# EAGLE design PLM_WiFi_Adapter (EAGLE 7.2.0)
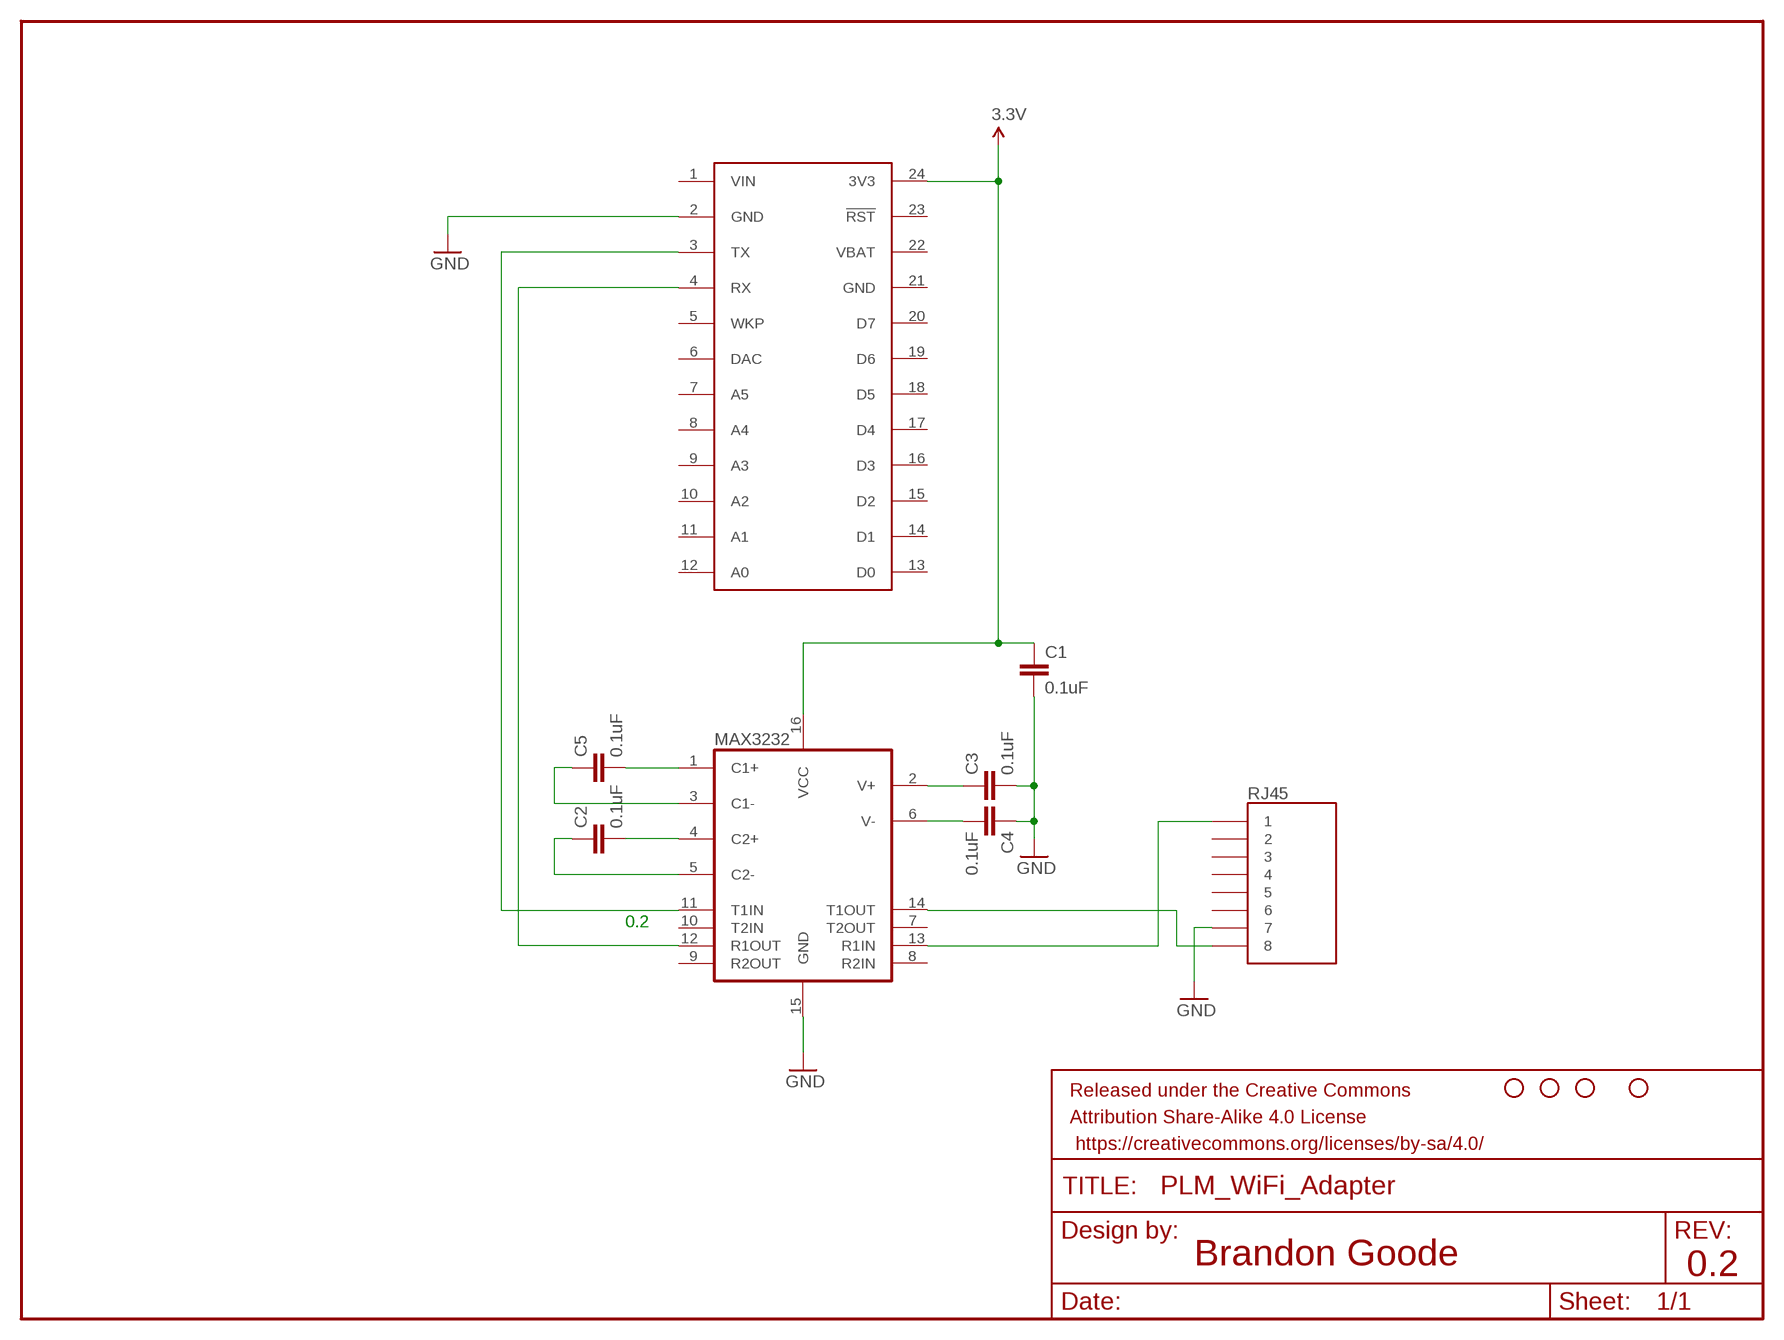
[diagram p0: schematic, sheet 1]

## Parts
C1  0.1uF  CAP0603-CAP  [0603-CAP]
C2  0.1uF  CAP0603-CAP  [0603-CAP]
C3  0.1uF  CAP0603-CAP  [0603-CAP]
C4  0.1uF  CAP0603-CAP  [0603-CAP]
C5  0.1uF  CAP0603-CAP  [0603-CAP]
FRAME1  FRAME-LETTER  [CREATIVE_COMMONS]
MAX3232  MAX232TSSOP  [TSSOP16]
RJ45  RJ45-8PTH  [RJ45-8]
SPARK  SPARK_CORECORE  [SPARK_CORE]
STANDOFF1  STAND-OFF  [STAND-OFF]
STANDOFF2  STAND-OFF  [STAND-OFF]
STANDOFF3  STAND-OFF  [STAND-OFF]
STANDOFF4  STAND-OFF  [STAND-OFF]

## Nets
3.3V: C1.1 MAX3232.16(VCC) SPARK.24(3V3)
GND: C1.2 C3.2 C4.1 MAX3232.15(GND) RJ45.7 SPARK.2(GND)
N$1: C5.2 MAX3232.1(C1+)
N$2: C3.1 MAX3232.2(V+)
N$3: C4.2 MAX3232.6(V-)
N$4: MAX3232.14(T1OUT) RJ45.8
N$5: MAX3232.13(R1IN) RJ45.1
N$6: C5.1 MAX3232.3(C1-)
N$7: C2.2 MAX3232.4(C2+)
N$8: C2.1 MAX3232.5(C2-)
N$9: MAX3232.11(T1IN) SPARK.3(TX)
N$10: MAX3232.12(R1OUT) SPARK.4(RX)
Unconnected: MAX3232.7(T2OUT) MAX3232.8(R2IN) MAX3232.9(R2OUT) MAX3232.10(T2IN) RJ45.2 RJ45.3 RJ45.4 RJ45.5 RJ45.6 SPARK.5(WKP) SPARK.6(DAC) SPARK.7(A5) SPARK.8(A4) SPARK.9(A3) SPARK.10(A2) SPARK.11(A1) SPARK.12(A0) SPARK.13(D0) SPARK.14(D1) SPARK.15(D2) SPARK.16(D3) SPARK.17(D4) SPARK.18(D5) SPARK.19(D6) SPARK.20(D7) SPARK.23(!RST)

## Notes on the sheet
- 0.2
- Brandon Goode
- 0.2

## Power pins joined to a net without a drawn wire
GND: SPARK.21(GND)
VBAT: SPARK.22(VBAT)
VIN: SPARK.1(VIN)

## Library data of the parts
C1-C5 = SparkFun-Passives:CAP: Capacitor Standard 0603 ceramic capacitor, and 0.1" leaded capacitor.
FRAME1 = SparkFun-Aesthetics:FRAME-LETTER: Schematic Frame Standard 8.5x11 US Letter frame
MAX3232 = SparkFun-DigitalIC:MAX232: RS232 Transceiver Very common IC. This is generically called 'MAX232', but works with the 3V equivalent MAX3232 generic ICs. Field tested and mother approved. Spark Fun Electronics SKU : COM-00316 (DIP) and COM-00589 (SMD)
RJ45 = SparkFun-Connectors:RJ45-8: RJ45 Jack Simple RJ45, 8-pin connection - connector for common Cat5, Cat5e, and Cat6 Ethernet cables. Footprint not yet proven in production. Connector sku is PRT-00643; Breakout PCB sku is BOB-00716.
SPARK = Spark:SPARK_CORE
STANDOFF1-STANDOFF4 = SparkFun-Electromechanical:STAND-OFF: #4 Stand Off This is the mechanical footprint for a #4 phillips button head screw. Use the keepout ring to avoid running the screw head into surrounding components. SKU : PRT-00447

## Board
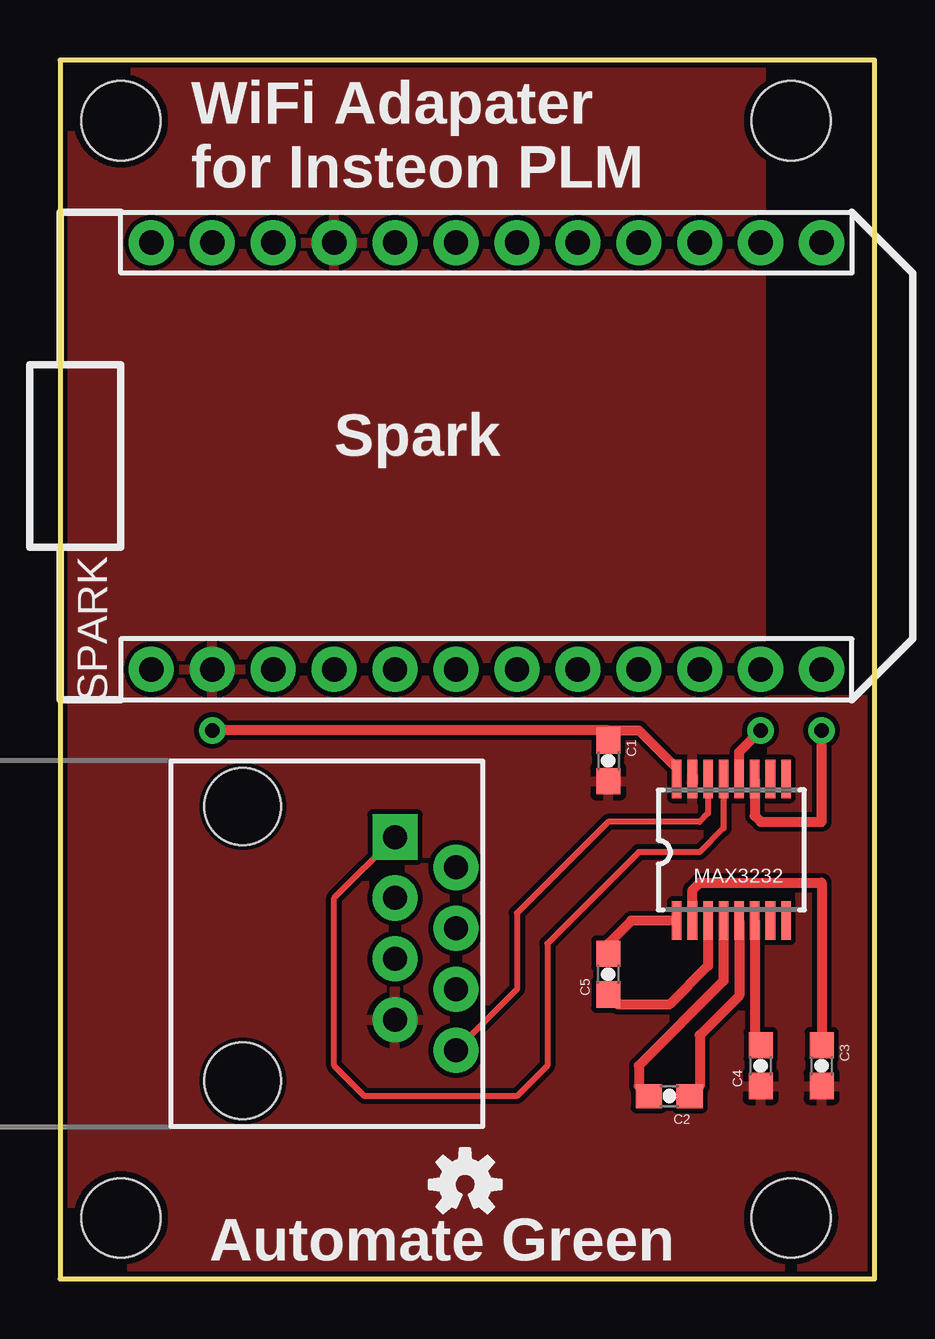
[diagram p1: board, top side]
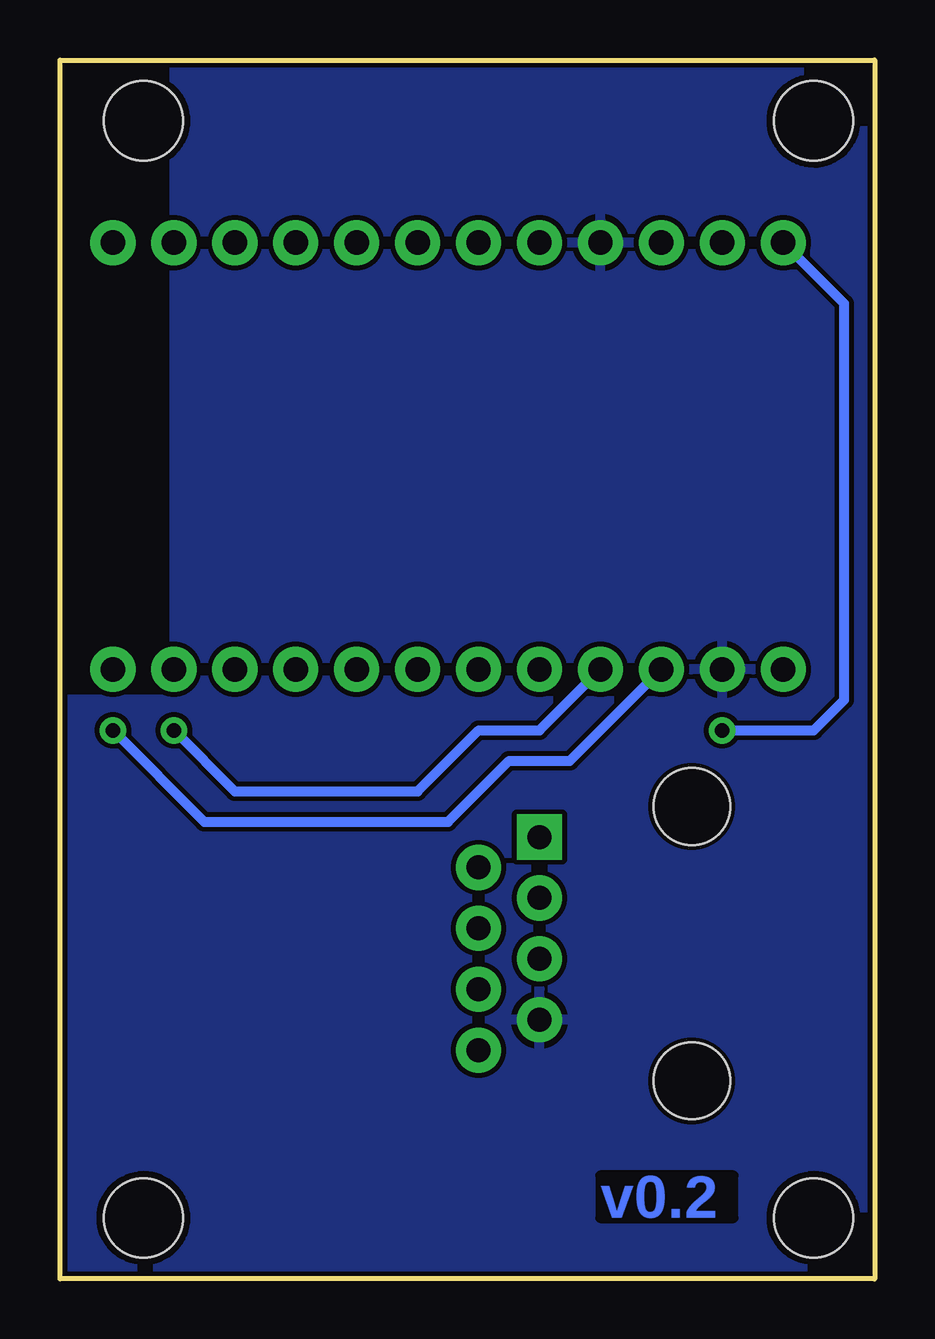
[diagram p2: board, bottom side, seen from below]

Size 33.96 x 50.79 mm. Coordinates in mm from the lower left corner, seen from the top.
Outline: 0,0 33.96,0 33.96,50.79 0,50.79 0,0
Copper layers (1*16): Top 0.035mm / dielectric 1.5mm / Bottom 0.035mm
Design rules "SparkFun-2-layer": minimum track width 7mil, minimum drill 15mil, track to track 8mil, track to pad 8mil, pad to pad 8mil, via to via 8mil, smd to smd 8mil, copper to edge 8mil, drill to drill 8mil, minimum pad ring 12mil, minimum via ring 10mil, stop-mask expansion 4mil, vias tented up to drill 20mil, thermal gap 10mil

### Footprints (pad centres in the part's own frame; a part is rotated, then mirrored left to right if it is on the bottom)
0603-CAP = smd 1.1 x 1: 1 -0.85,0; 2 0.85,0
TSSOP16 = smd 0.4 x 1.6: 1 -2.225,-2.85; 2 -1.575,-2.85; 3 -0.925,-2.85; 4 -0.275,-2.85; 5 0.375,-2.85; 6 1.025,-2.85; 7 1.675,-2.85; 8 2.325,-2.85; 9 2.325,3.05; 10 1.675,3.05; 11 1.025,3.05; 12 0.375,3.05; 13 -0.275,3.05; 14 -0.925,3.05; 15 -1.575,3.05; 16 -2.225,3.05
RJ45-8 = drill 1 pad 1.88 square: 1 -4.445,6.35 | drill 1 pad 1.88: 2 -3.175,8.89; 3 -1.905,6.35; 4 -0.635,8.89; 5 0.635,6.35; 6 1.905,8.89; 7 3.175,6.35; 8 4.445,8.89 | hole 3.2: -5.715,0; 5.715,0
SPARK_CORE = drill 1.016 pad 1.88: 1 -8.89,13.97; 2 -8.89,11.43; 3 -8.89,8.89; 4 -8.89,6.35; 5 -8.89,3.81; 6 -8.89,1.27; 7 -8.89,-1.27; 8 -8.89,-3.81; 9 -8.89,-6.35; 10 -8.89,-8.89; 11 -8.89,-11.43; 12 -8.89,-13.97; 13 8.89,-13.97; 14 8.89,-11.43; 15 8.89,-8.89; 16 8.89,-6.35; 17 8.89,-3.81; 18 8.89,-1.27; 19 8.89,1.27; 20 8.89,3.81; 21 8.89,6.35; 22 8.89,8.89; 23 8.89,11.43; 24 8.89,13.97
STAND-OFF = hole 3.302: 0,0

### Placement (x,y rotation side)
C1  22.86,21.59 270 top
C2  25.4,7.62 180 top
C3  31.75,8.89 270 top
C4  29.21,8.89 90 top
C5  22.86,12.7 90 top
FRAME1  -2.54,-8.89 0 top  (outside the outline)
MAX3232  27.94,17.78 0 top
RJ45  7.62,13.97 270 top
SPARK  17.78,34.29 90 top
STANDOFF1  2.54,2.54 0 top
STANDOFF2  2.54,48.26 0 top
STANDOFF3  30.48,48.26 0 top
STANDOFF4  30.48,2.54 0 top
U$1  [OSHW-LOGO-S]  16.89,3.94 0 top

### Tracks (layer width: path | path; a pad name or v marks a point on that pad's centre or on a via)
3.3V  (via drill 0.6)
  Top 0.406: MAX3232.16 25.71,21.27 24.13,22.86 22.86,22.86 | 22.86,22.86 C1.1 | 22.86,22.86 v6.35,22.86
  Bottom 0.406: v6.35,22.86 2.54,22.86 1.27,24.13 1.27,40.64 SPARK.24
GND
  pour Bottom: 0,50.8 29.21,50.8 29.21,24.13 34.29,24.13 34.29,0 0,0
  pour Top: 0,50.8 29.21,50.8 29.21,24.13 34.29,24.13 34.29,0 0,0
N$1
  Top 0.406: MAX3232.1 23.82,14.93 22.86,13.97 C5.2
N$2
  Top 0.406: MAX3232.2 26.36,16.2 26.67,16.51 31.75,16.51 C3.1
N$3
  Top 0.406: MAX3232.6 28.96,9.98 C4.2
N$4
  Top 0.254: MAX3232.14 27.02,19.39 26.67,19.05 22.86,19.05 19.05,15.24 19.05,12.06 RJ45.8
N$5
  Top 0.254: MAX3232.13 27.66,18.77 26.67,17.78 24.13,17.78 20.32,13.97 20.32,8.89 19.05,7.62 12.7,7.62 11.43,8.89 11.43,15.88 RJ45.1
N$6
  Top 0.406: MAX3232.3 27.02,13.04 25.4,11.43 23.28,11.43 C5.1
N$7
  Top 0.406: MAX3232.4 27.66,12.43 24.13,8.89 24.13,8.04 C2.2
N$8
  Top 0.406: MAX3232.5 28.32,11.8 26.67,10.16 26.67,8.04 C2.1
N$9  (via drill 0.6)
  Top 0.406: MAX3232.11 28.96,19.3 29.21,19.05 31.75,19.05 v31.75,22.86
  Bottom 0.406: v31.75,22.86 27.94,19.05 17.78,19.05 15.24,21.59 12.7,21.59 SPARK.3
N$10  (via drill 0.6)
  Top 0.406: MAX3232.12 28.32,21.96 v29.21,22.86
  Bottom 0.406: v29.21,22.86 26.67,20.32 19.05,20.32 16.51,22.86 13.97,22.86 SPARK.4

### Text on the board
Bottom: v0.2
tPlace: WiFi Adapater / for Insteon PLM | Spark | Automate Green
tDocu: Brandon Goode